# EAGLE design megajolt2 (EAGLE 4.16)
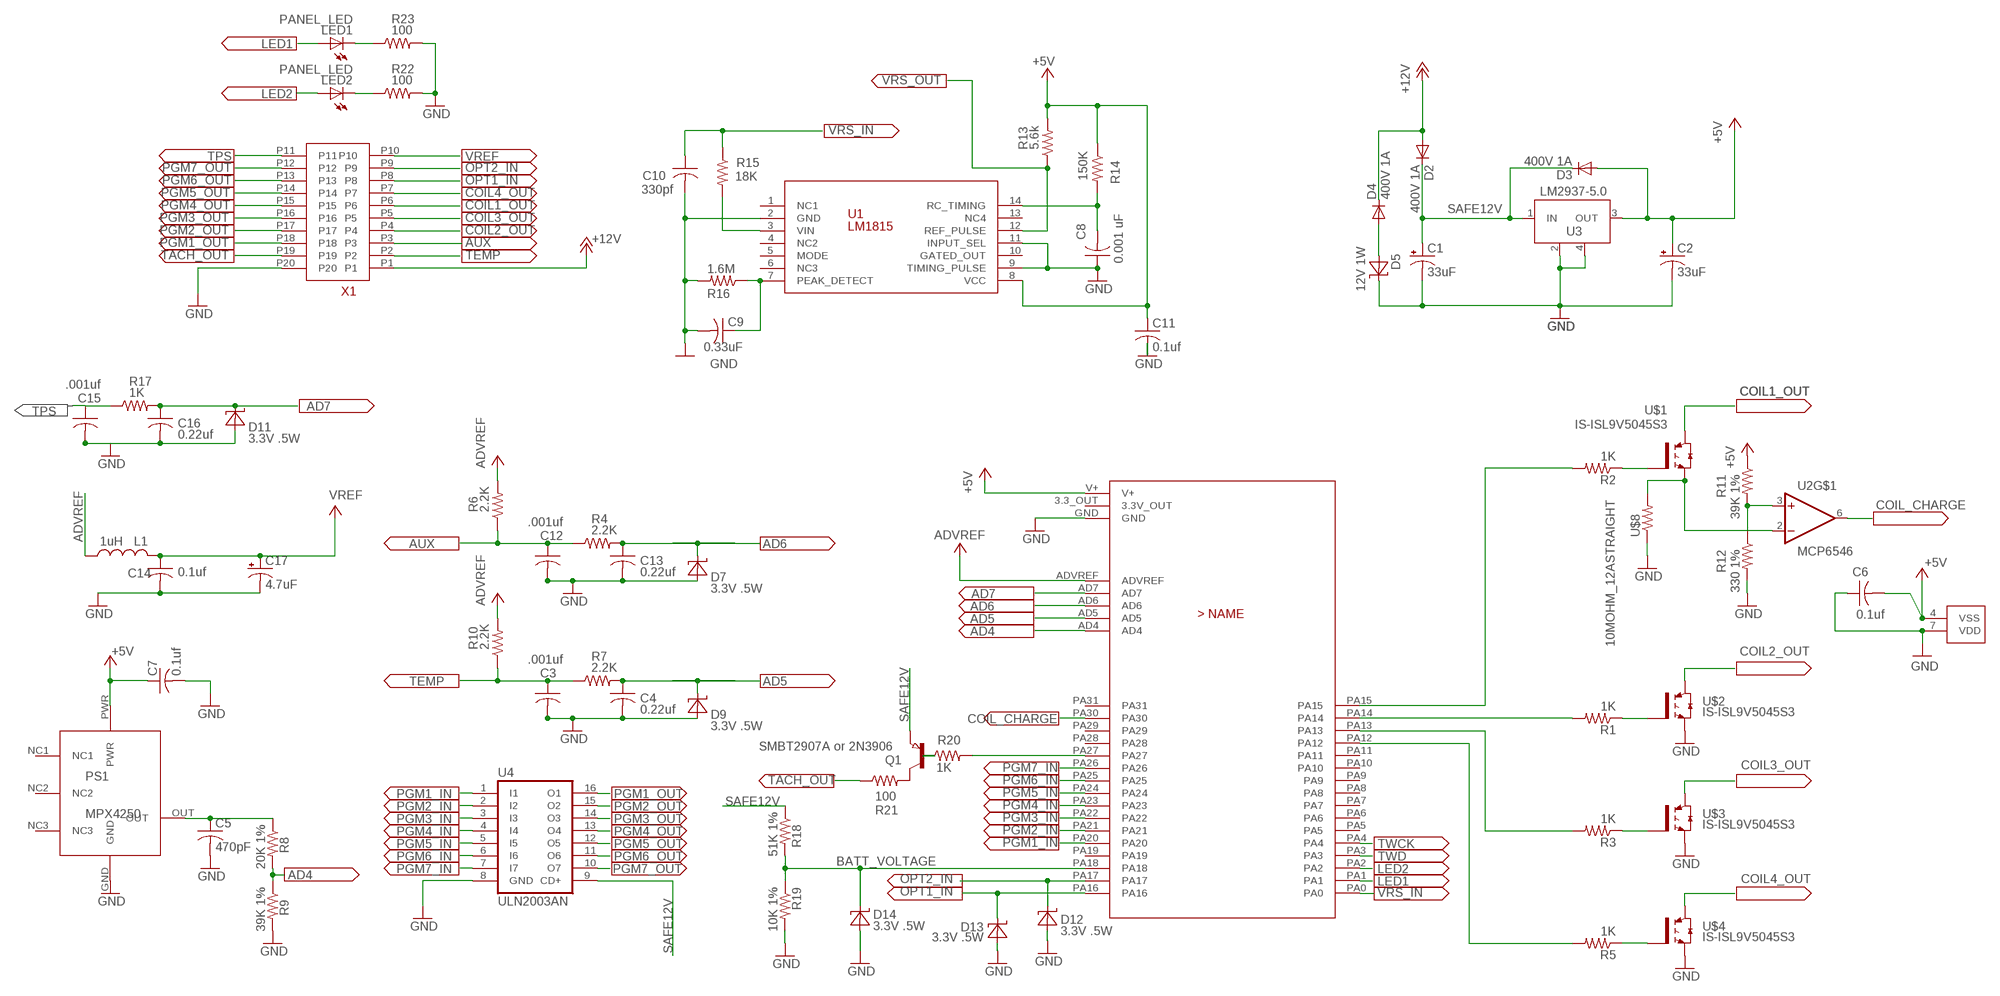
[diagram p0: schematic, sheet 1]

## Parts
C1  33uF  CPOL-US153CLV-0605  [153CLV-0605]
C2  33uF  CPOL-USSMCD  [SMC_D]
C3  .001uf  C-USC1206K  [C1206K]
C4  0.22uf  C-USC1206K  [C1206K]
C5  470pF  C-USC1206K  [C1206K]
C6  0.1uf  C-USC1206K  [C1206K]
C7  0.1uf  C-USC1206K  [C1206K]
C8  0.001 uF  C-USC1206K  [C1206K]
C9  0.33uF  C-USC1206K  [C1206K]
C10  330pf  C-USC1206K  [C1206K]
C11  0.1uf  C-USC1206K  [C1206K]
C12  .001uf  C-USC1206K  [C1206K]
C13  0.22uf  C-USC1206K  [C1206K]
C14  0.1uf  C-USC1206K  [C1206K]
C15  .001uf  C-USC1206K  [C1206K]
C16  0.22uf  C-USC1206K  [C1206K]
C17  4.7uF  CPOL-USSMCD  [SMC_D]
CPU_MODULE  CPU_MODULE  [CPU_MODULE]
D2  400V 1A  DIODE1  [SMA]
D3  400V 1A  DIODE1  [SMA]
D4  400V 1A  DIODE1  [SMA]
D5  12V 1W  ZENER2  [SOD123]
D7  3.3V .5W  ZENER2  [SOD123]
D9  3.3V .5W  ZENER2  [SOD123]
D11  3.3V .5W  ZENER2  [SOD123]
D12  3.3V .5W  ZENER2  [SOD123]
D13  3.3V .5W  ZENER2  [SOD123]
D14  3.3V .5W  ZENER2  [SOD123]
L1  1uH  INDUCTOR  [1210]
LED1  PANEL_LED  [RIGHTANGLE_CML_5323F5]
LED2  PANEL_LED  [RIGHTANGLE_CML_5323F5]
PS1  MPX4250  [MPX4250]
Q1  SMBT2907A or 2N3906  PNP-TRANSISTOR_SOT23  [SOT23]
R1  1K  R-US_M1206  [M1206]
R2  1K  R-US_M1206  [M1206]
R3  1K  R-US_M1206  [M1206]
R4  2.2K  R-US_M1206  [M1206]
R5  1K  R-US_M1206  [M1206]
R6  2.2K  R-US_M1206  [M1206]
R7  2.2K  R-US_M1206  [M1206]
R8  20K 1%  R-US_M1206  [M1206]
R9  39K 1%  R-US_M1206  [M1206]
R10  2.2K  R-US_M1206  [M1206]
R11  39K 1%  R-US_M1206  [M1206]
R12  330 1%  R-US_M1206  [M1206]
R13  5.6k  R-US_M1206  [M1206]
R14  150K  R-US_M1206  [M1206]
R15  18K  R-US_M1206  [M1206]
R16  1.6M  R-US_M1206  [M1206]
R17  1K  R-US_R1206  [R1206]
R18  51K 1%  R-US_M1206  [M1206]
R19  10K 1%  R-US_M1206  [M1206]
R20  1K  R-US_M1206  [M1206]
R21  100  R-US_M1206  [M1206]
R22  100  R-US_M1206  [M1206]
R23  100  R-US_M1206  [M1206]
U1  LM1815  [DIL14]
U2  MCP6546  [DIL08]
U3  LM2937-5.0  LM2937  [SOT223]
U4  ULN2003AN  [DIL16]
U$1  IS-ISL9V5045S3  [D2-PAK]
U$2  IS-ISL9V5045S3  [D2-PAK]
U$3  IS-ISL9V5045S3  [D2-PAK]
U$4  IS-ISL9V5045S3  [D2-PAK]
U$8  10MOHM_12ASTRAIGHT  [10MOHM_STRAIGHT_12A_CAPACITY]
X1  MOLEX_MINIFIT-20  MOLEX_MINIFIT-20NO_PEG  [MOLEX_MINIFIT-20_NO_PEG]

## Nets
+5V: C2.+ C6.2 C7.1 C11.1 CPU_MODULE.V+ D3.A PS1.PWR R11.1 R13.2 R14.1 U1.8(VCC) U2.4(VSS) U3.3(OUT)
+12V: D2.A D4.C X1.P1
AD4: CPU_MODULE.AD4 R8.2 R9.1
AD5: C4.1 CPU_MODULE.AD5 D9.C R7.2
AD6: C13.1 CPU_MODULE.AD6 D7.C R4.2
AD7: C16.1 CPU_MODULE.AD7 D11.C R17.2
ADVREF: CPU_MODULE.ADVREF L1.1
AUX: C12.1 R4.1 R6.1 X1.P3
BATT_VOLTAGE: CPU_MODULE.PA18 D14.C R18.2 R19.1
COIL1_DRIVE: CPU_MODULE.PA15 R2.2
COIL1_OUT: U$1.2(C) X1.P6
COIL2_DRIVE: CPU_MODULE.PA14 R1.2
COIL2_OUT: U$2.2(C) X1.P4
COIL3_DRIVE: CPU_MODULE.PA13 R3.2
COIL3_OUT: U$3.2(C) X1.P5
COIL4_DRIVE: CPU_MODULE.PA12 R5.2
COIL4_OUT: U$4.2(C) X1.P7
COIL_CHARGE: CPU_MODULE.PA30 U2.6(OUT)
GND: C1.- C2.- C3.2 C4.2 C5.2 C6.1 C7.2 C8.1 C9.2 C10.2 C11.2 C12.2 C13.2 C14.2 C15.2 C16.2 C17.- CPU_MODULE.GND D5.C D7.A D9.A D11.A D12.A D13.A D14.A PS1.GND R9.2 R12.2 R16.2 R19.2 R22.2 R23.2 U1.2(GND) U1.9(TIMING_PULSE) U1.11(INPUT_SEL) U2.7(VDD) U3.2(GND) U3.4(GND_TAB) U4.8(GND) U$2.3(E) U$3.3(E) U$4.3(E) U$8.P$1 X1.P20
LED1: CPU_MODULE.PA1 LED1.A
LED2: CPU_MODULE.PA2 LED2.A
N$1: R2.1 U$1.1(G)
N$2: R1.1 U$2.1(G)
N$5: D4.A D5.A
N$7: R3.1 U$3.1(G)
N$9: R5.1 U$4.1(G)
N$10: R11.2 R12.1 U2.3(+IN)
N$11: U2.2(-IN) U$1.3(E) U$8.P$2
N$12: C5.1 PS1.OUT R8.1
N$13: C8.2 R14.2 U1.14(RC_TIMING)
N$15: R15.2 U1.3(VIN)
N$16: C9.1 R16.1 U1.7(PEAK_DETECT)
N$19: Q1.1(B) R20.1
N$20: CPU_MODULE.PA27 R20.2
N$21: LED1.C R23.1
N$22: LED2.C R22.1
OPT1_IN: CPU_MODULE.PA16 D13.C X1.P8
OPT2_IN: CPU_MODULE.PA17 D12.C X1.P9
PGM1_IN: CPU_MODULE.PA20 U4.1(I1)
PGM1_OUT: U4.16(O1) X1.P18
PGM2_IN: CPU_MODULE.PA21 U4.2(I2)
PGM2_OUT: U4.15(O2) X1.P17
PGM3_IN: CPU_MODULE.PA22 U4.3(I3)
PGM3_OUT: U4.14(O3) X1.P16
PGM4_IN: CPU_MODULE.PA23 U4.4(I4)
PGM4_OUT: U4.13(O4) X1.P15
PGM5_IN: CPU_MODULE.PA24 U4.5(I5)
PGM5_OUT: U4.12(O5) X1.P14
PGM6_IN: CPU_MODULE.PA25 U4.6(I6)
PGM6_OUT: U4.11(O6) X1.P13
PGM7_IN: CPU_MODULE.PA26 U4.7(I7)
PGM7_OUT: U4.10(O7) X1.P12
SAFE12V: C1.+ D2.C D3.C Q1.2(E) R18.1 U3.1(IN) U4.9(CD+)
TACH_OUT: R21.1 X1.P19
TACH_OUT_TRANSISTOR: Q1.3(C) R21.2
TEMP: C3.1 R7.1 R10.1 X1.P2
TPS: C15.1 R17.1 X1.P11
TWCK: CPU_MODULE.PA4
TWD: CPU_MODULE.PA3
VCCIO: R6.2 R10.2 ; supply symbol labelled ADVREF
VREF: C14.1 C17.+ L1.2 X1.P10
VRS_IN: C10.1 CPU_MODULE.PA0 R15.1
VRS_OUT: R13.1 U1.12(REF_PULSE)
Unconnected: CPU_MODULE.3.3_OUT(3.3V_OUT) CPU_MODULE.PA5 CPU_MODULE.PA6 CPU_MODULE.PA7 CPU_MODULE.PA8 CPU_MODULE.PA9 CPU_MODULE.PA10 CPU_MODULE.PA11 CPU_MODULE.PA19 CPU_MODULE.PA28 CPU_MODULE.PA29 CPU_MODULE.PA31 U1.1(NC1) U1.4(NC2) U1.5(MODE) U1.6(NC3) U1.10(GATED_OUT) U1.13(NC4)

## Power pins joined to a net without a drawn wire
NC1: PS1.NC1
NC2: PS1.NC2
NC3: PS1.NC3

## Library data of the parts
C1 C2 C17 = rcl:CPOL-US: POLARIZED CAPACITOR, American symbol
C3-C16 = rcl:C-US: CAPACITOR, American symbol
CPU_MODULE = cpu_module:CPU_MODULE
D2-D4 = smt_diodes:DIODE
D5 D7 D9 D11-D14 = smt_diodes:ZENER
L1 = smt_inductors:INDUCTOR
LED1 LED2 = LEDs:PANEL_LED
PS1 = pressure_sensor:MPX4250
Q1 = semicon-smd-ipc:PNP-TRANSISTOR_: PNP TRANSISTOR
R1-R23 = rcl:R-US_: RESISTOR, American symbol
U1 = lm1815:LM1815
U2 = microchip_comparators:MCP6546
U3 = voltage_regulators:LM2937
U4 = uln-udn:ULN2003A: DRIVER ARRAY
U$1-U$4 = Fairchild_ecospark_IGBT:IS-ISL9V5045S3
U$8 = current_sense_trace:10MOHM_12A
X1 = molex_mini-fit:MOLEX_MINIFIT-20

## Board
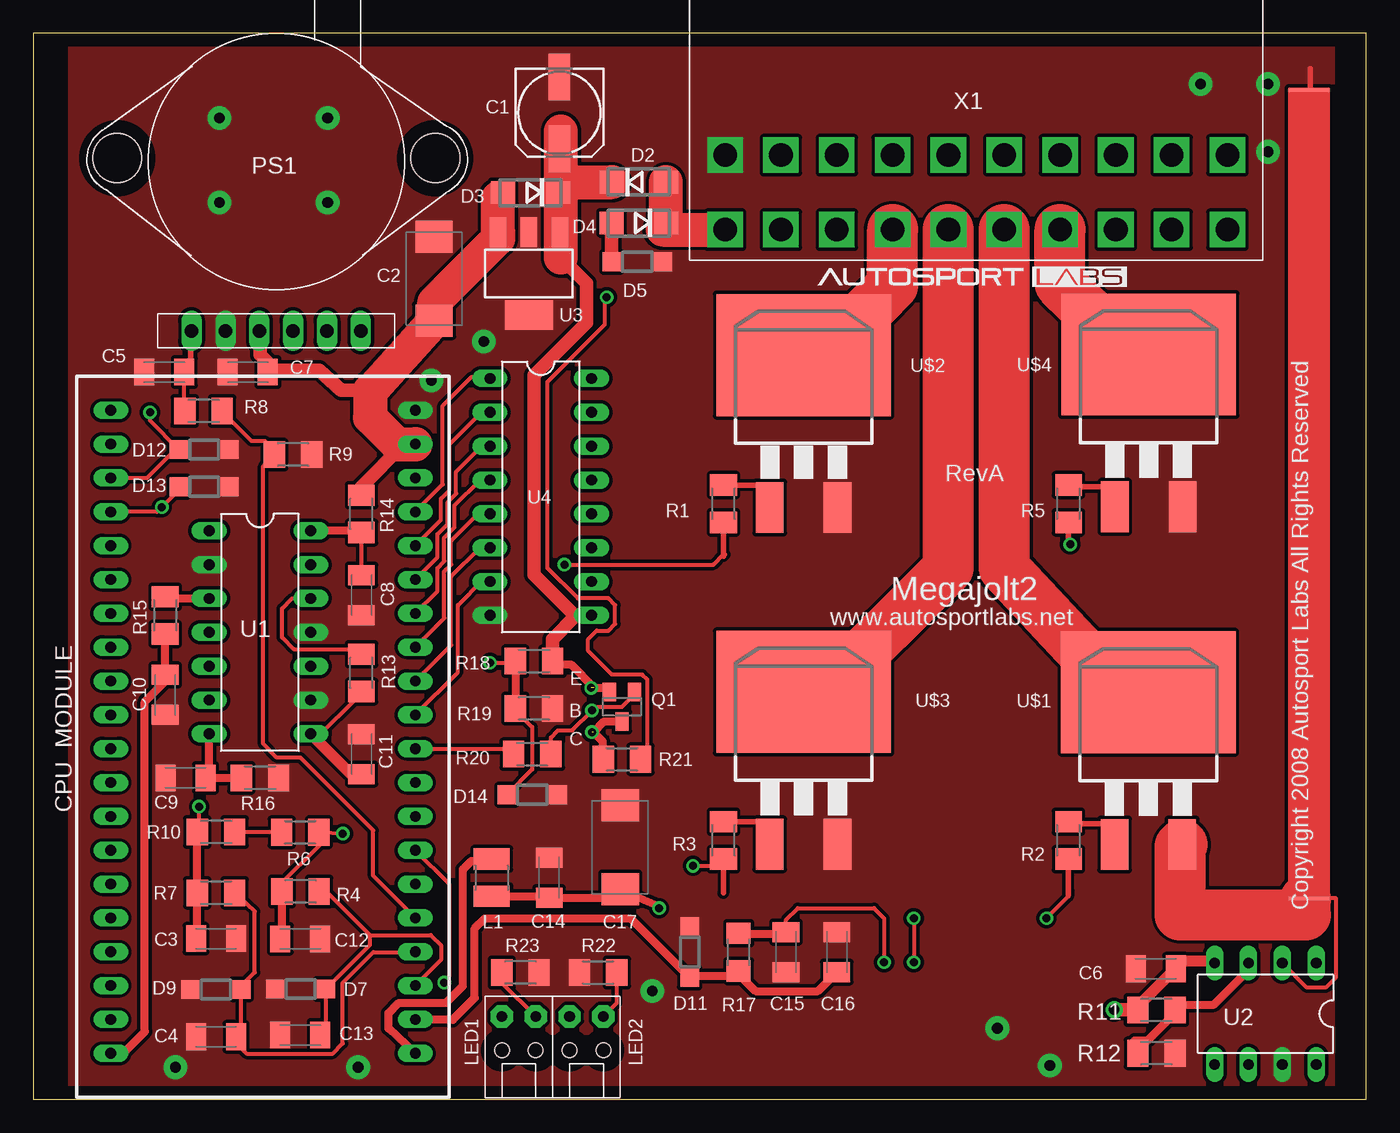
[diagram p1: board, top side]
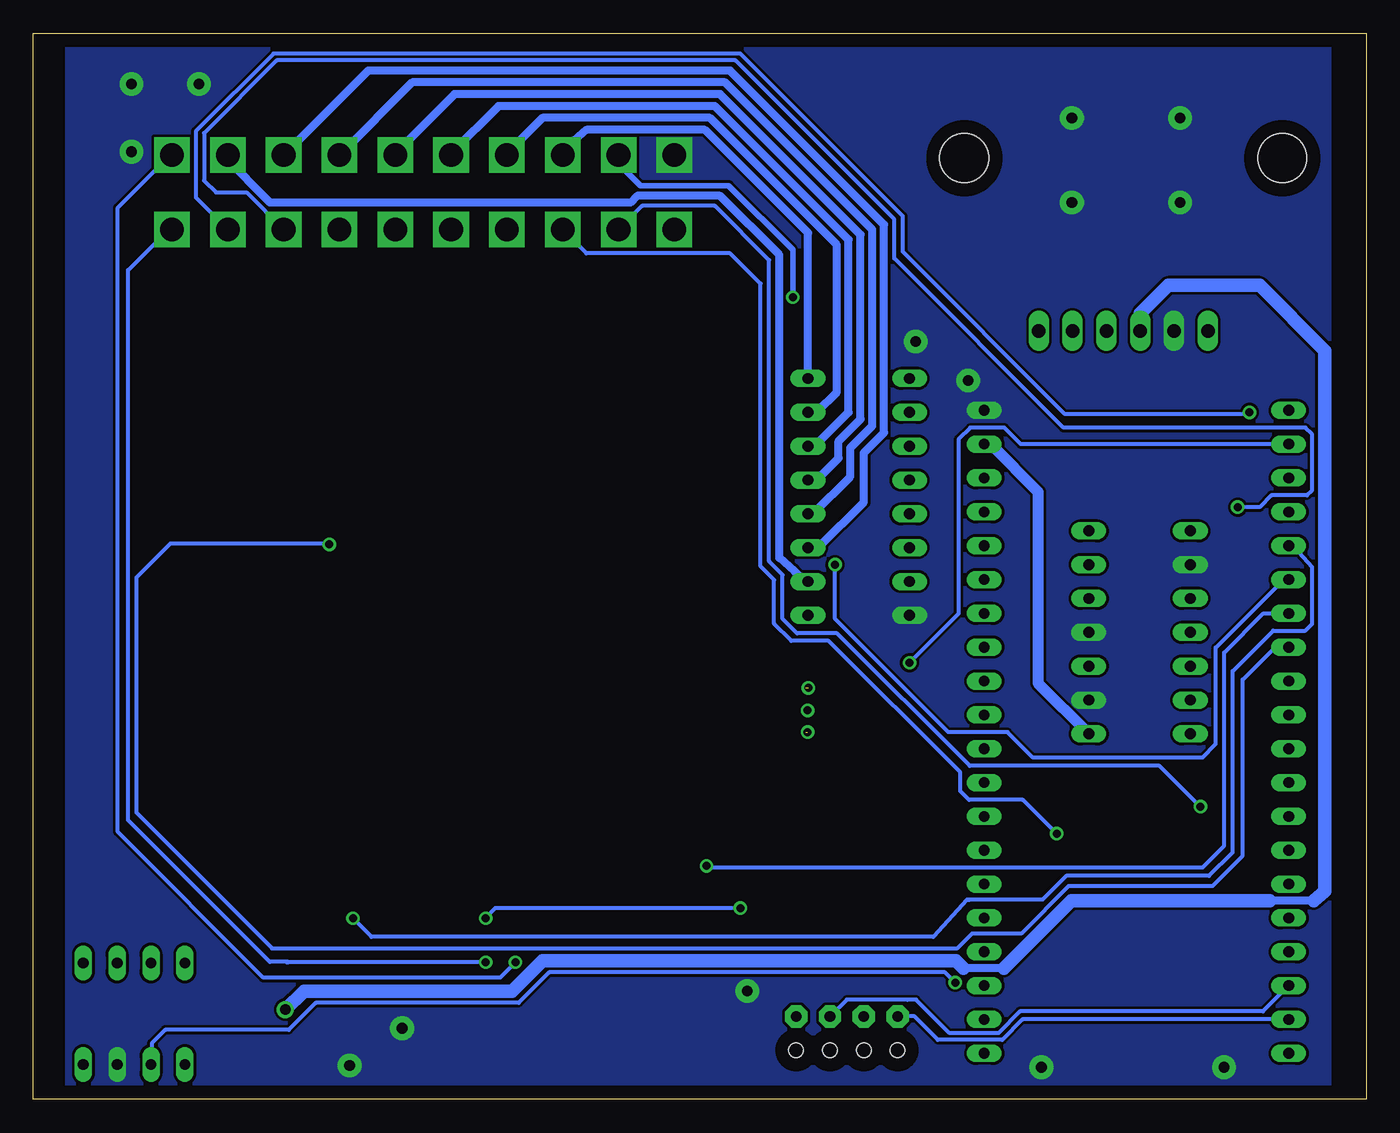
[diagram p2: board, bottom side, seen from below]

Size 100.08 x 80.01 mm. Coordinates in mm from the lower left corner, seen from the top.
Outline: 0,0 100.08,0 100.08,80.01 0,80.01 0,0
Copper layers (1*16): Top 0.035mm / dielectric 1.5mm / Bottom 0.035mm
Design rules "default": minimum track width 10mil, minimum drill 24mil, track to track 8mil, track to pad 8mil, pad to pad 8mil, via to via 8mil, smd to smd 8mil, copper to edge 40mil, drill to drill 8mil, minimum pad ring 10mil, minimum via ring 8mil, stop-mask expansion 4mil, vias tented up to drill 0mil, thermal gap 10mil

### Footprints (pad centres in the part's own frame; a part is rotated, then mirrored left to right if it is on the bottom)
153CLV-0605 = smd 3.5 x 1.6: + 2.7,0; - -2.7,0
SMC_D = smd 2.4 x 2.8: + -3.15,0; - 3.15,0
C1206K = smd 1.5 x 2: 1 -1.5,0; 2 1.5,0
CPU_MODULE = drill 0.8 long: 3.3_OUT -20.32,12.7; AD4 12.7,12.7; AD5 15.24,12.7; AD6 17.78,12.7; AD7 20.32,12.7; ADVREF 22.86,12.7; GND -25.4,12.7; PA0 22.86,-10.16; PA1 20.32,-10.16; PA2 17.78,-10.16; PA3 15.24,-10.16; PA4 12.7,-10.16; PA5 10.16,-10.16; PA6 7.62,-10.16; PA7 5.08,-10.16; PA8 2.54,-10.16; PA9 0,-10.16; PA10 -2.54,-10.16; PA11 -5.08,-10.16; PA12 -7.62,-10.16; PA13 -10.16,-10.16; PA14 -12.7,-10.16; PA15 -15.24,-10.16; PA16 -17.78,-10.16; PA17 -20.32,-10.16; PA18 -22.86,-10.16; PA19 -25.4,-10.16; PA20 -17.78,12.7; PA21 -15.24,12.7; PA22 -12.7,12.7; PA23 -10.16,12.7; PA24 -7.62,12.7; PA25 -5.08,12.7; PA26 -2.54,12.7; PA27 0,12.7; PA28 2.54,12.7; PA29 5.08,12.7; PA30 7.62,12.7; PA31 10.16,12.7; V+ -22.86,12.7
SMA = smd 1.8 x 1.7: A 2.05,0; C -2.05,0
SOD123 = smd 1.4 x 1.4: A 1.9,0; C -1.9,0
1210 = smd 1.6 x 2.7: 1 -1.4,0; 2 1.4,0
RIGHTANGLE_CML_5323F5 = drill 0.8 pad 1.676 octagon: A -1.27,1.651; C 1.27,1.651 | hole 1.1: 1.27,-0.889; -1.27,-0.889
MPX4250 = drill 1.016 long: GND 3.81,0; NC1 -1.27,0; NC2 -3.81,0; NC3 -6.35,0; OUT 6.35,0; PWR 1.27,0 | hole 3.683: -11.938,-12.954; 11.938,-12.954
SOT23 = smd 1 x 1.4: 1 -0.95,-1.1; 2 0.95,-1.1; 3 0,1.1
M1206 = smd 1.6 x 2: 1 -1.4,0; 2 1.4,0
R1206 = smd 1.6 x 1.803: 1 -1.422,0; 2 1.422,0
DIL14 = drill 0.813 long: 1 -7.62,-3.81; 2 -5.08,-3.81; 3 -2.54,-3.81; 4 0,-3.81; 5 2.54,-3.81; 6 5.08,-3.81; 7 7.62,-3.81; 8 7.62,3.81; 9 5.08,3.81; 10 2.54,3.81; 11 0,3.81; 12 -2.54,3.81; 13 -5.08,3.81; 14 -7.62,3.81
DIL08 = drill 0.813 long: 1 -3.81,-3.81; 2 -1.27,-3.81; 3 1.27,-3.81; 4 3.81,-3.81; 5 3.81,3.81; 6 1.27,3.81; 7 -1.27,3.81; 8 -3.81,3.81
SOT223 = smd 1.219 x 2.235: 1 -2.311,-3.099; 2 0,-3.099; 3 2.311,-3.099 | smd 3.6 x 2.2: 4 0,3.099
DIL16 = drill 0.813 long: 1 -8.89,-3.81; 2 -6.35,-3.81; 3 -3.81,-3.81; 4 -1.27,-3.81; 5 1.27,-3.81; 6 3.81,-3.81; 7 6.35,-3.81; 8 8.89,-3.81; 9 8.89,3.81; 10 6.35,3.81; 11 3.81,3.81; 12 1.27,3.81; 13 -1.27,3.81; 14 -3.81,3.81; 15 -6.35,3.81; 16 -8.89,3.81
D2-PAK = smd 2.083 x 3.81: 1 -2.54,-10.16; 3 2.54,-10.16 | smd 13.107 x 9.144: 2 0,1.27
10MOHM_STRAIGHT_12A_CAPACITY = smd 0.254 x 3.048: P$1 0.127,1.524; P$2 60.833,1.524
MOLEX_MINIFIT-20_NO_PEG = drill 1.778 pad 2.54 square: P1 -18.923,-2.794; P2 -14.732,-2.794; P3 -10.541,-2.794; P4 -6.35,-2.794; P5 -2.159,-2.794; P6 2.032,-2.794; P7 6.223,-2.794; P8 10.414,-2.794; P9 14.605,-2.794; P10 18.796,-2.794; P11 18.796,2.794; P12 14.605,2.794; P13 10.414,2.794; P14 6.223,2.794; P15 2.032,2.794; P16 -2.159,2.794; P17 -6.35,2.794; P18 -10.541,2.794; P19 -14.732,2.794; P20 -18.923,2.794

### Placement (x,y rotation side)
C1  39.5,74.04 270 top
C2  30.1,61.59 90 top
C3  13.72,12.06 0 top
C4  13.72,4.7 180 top
C5  9.83,54.58 180 top
C6  84.28,9.8 0 top
C7  16.1,54.58 180 top
C8  24.64,37.85 90 top
C9  11.43,24.13 180 top
C10  9.91,30.35 270 top
C11  24.64,25.91 90 top
C12  20.04,12.04 0 top
C13  20.04,4.83 180 top
C14  38.73,16.64 90 top
C15  56.52,11.05 270 top
C16  60.33,11.05 90 top
C17  44.07,18.92 90 top
CPU_MODULE  15.98,26.31 270 top
D2  45.47,68.83 0 top
D3  37.34,68.07 180 top
D4  45.47,65.79 180 top
D5  45.34,62.87 180 top
D7  20.07,8.28 180 top
D9  13.72,8.26 180 top
D11  49.28,11.05 90 top
D12  12.83,48.77 0 top
D13  12.83,45.97 0 top
D14  37.47,22.86 0 top
L1  34.42,16.64 270 top
LED1  36.45,4.57 0 top
LED2  41.53,4.57 0 top
PS1  18.24,57.68 180 top
Q1  44.2,29.46 180 top
R1  51.82,44.7 270 top
R2  77.72,19.43 270 top
R3  51.82,19.43 270 top
R4  20.07,15.6 0 top
R5  77.72,44.7 270 top
R6  20.04,20.04 180 top
R7  13.72,15.49 0 top
R8  12.78,51.66 0 top
R9  19.51,48.39 0 top
R10  13.72,20.07 0 top
R11  84.33,6.71 0 top
R12  84.33,3.45 0 top
R13  24.64,32 270 top
R14  24.64,43.94 270 top
R15  9.91,36.32 90 top
R16  17.02,24.13 0 top
R17  52.96,11.05 270 top
R18  37.59,32.89 180 top
R19  37.59,29.34 0 top
R20  37.47,25.91 180 top
R21  44.2,25.53 180 top
R22  42.42,9.53 180 top
R23  36.58,9.53 0 top
U1  17.02,35.05 270 top
U2  92.51,6.43 180 top
U3  37.21,61.98 180 top
U4  38.1,45.21 270 top
U$1  83.72,29.29 0 top
U$2  57.84,54.58 0 top
U$3  57.84,29.31 0 top
U$4  83.74,54.64 0 top
U$8  94.26,75.9 270 top
X1  70.87,68.07 0 top

### Tracks (layer width: path | path; a pad name or v marks a point on that pad's centre or on a via)
+5V  (via drill 0.8 pad 1.27)
  Top 0.254: 24.13,30.48 R13.2 | D3.A 35.56,68.58 34.9,67.67
  Top 0.305: R13.2 24.64,31.24 | 24.13,30.48 24.13,29.97 21.59,27.43 20.95,27.43 20.83,27.56 U1.8
  Top 0.61: 18.16,54.74 17.5,55.35 C7.1 | PS1.PWR 16.97,58.47 | 85.47,10.41 85.47,10.37 C6.2 | 88.37,10.41 U2.4 | C6.2 85.47,10.26 | C6.2 85.5,10.29 85.47,10.29 85.47,10.01 | 85.85,9.91 85.78,9.83 C6.2 | R11.1 82.93,6.98
  Top 0.813: 85.47,10.41 88.37,10.41 | 24.66,24.38 24.77,24.38 | 24.66,24.38 C11.1 | U1.8 23.88,24.38 24.66,24.38 | R11.1 82.91,6.71 | 82.93,6.98 85.78,9.83
  Top 1.016: 24.64,45.21 R14.1 24.64,45.97 27.81,49.15 | 25.27,53.21 23.11,53.21 21.46,54.74 18.16,54.74 17.02,55.88 17.02,58.5 | 17.02,58.5 17.02,58.55 | PS1.PWR 17.02,58.5 | R11.1 82.83,6.71 82.8,6.73 v81.15,6.73
  Top 2.54: C2.+ 30.1,58.93 | C2.+ 30.1,59.82 34.9,64.62 U3.3 34.9,67.67 | 25.27,53.11 C2.+ | 25.27,53.11 25.27,51.18 27.3,49.15 27.81,49.15 28.7,49.15 CPU_MODULE.V+ | 25.27,53.21 25.27,53.11
  Bottom 0.61: 16.84,58.43 17.02,58.48 | 16.84,58.43 PS1.PWR | 16.95,58.99 16.89,58.99 16.84,58.43 | 3.94,14.92 7.24,14.92 | 27.11,9.84 27.2,9.84 30.23,9.84
  Bottom 0.813: U1.8 24.64,31.24 24.64,45.59 28.19,49.15 28.7,49.15 | 28.7,49.15 28.83,49.15 | CPU_MODULE.V+ 28.7,49.15
  Bottom 1.016: 16.95,58.99 14.86,61.09 8,61.09 3.11,56.2 3.11,15.62 3.94,14.92 | 30.23,9.84 30.8,10.41 61.85,10.41 64.14,8.13 79.76,8.13 v81.15,6.73 | 27.2,9.84 27.2,9.86 22.14,14.92 7.24,14.92
+12V
  Top 0.61: 47.24,65.28 47.24,65.79 D4.C 47.5,65.79 | 47.5,68.83 D2.A
  Top 2.54: 47.24,65.28 X1.P1 | 47.5,65.79 47.5,68.83
AD4
  Top 0.254: R8.2 13.97,52.07 14.22,51.56
  Top 0.305: 28.7,13.59 CPU_MODULE.AD4 25.53,16.76 25.53,20.19 20.07,25.65 18.29,25.65 17.27,26.67 17.27,47.5 18.16,48.39 R9.1 17.53,49.28 17.4,49.4 16.38,49.4 14.22,51.56
AD5
  Top 0.305: R7.2 16.64,14.1 16.64,9.53 15.62,8.51 | 15.62,5.1 D9.C | 15.37,4.06 16,3.43 22.48,3.43 23.24,4.19 23.24,8.76 25.53,11.05 28.65,11.05 CPU_MODULE.AD5
  Top 0.61: 15.62,8.51 D9.C | C4.1 15.62,5.1 | 15.37,4.57 15.34,4.57 C4.1 | C4.1 15.37,4.7 15.37,4.06
AD6
  Top 0.305: CPU_MODULE.AD6 30.61,10.46 30.61,11.56 29.84,12.32 25.27,12.32 | 25.27,12.32 21.46,16.13 | D7.C 21.97,8.38 | D7.C 25.27,11.59 25.27,12.32 | C13.1 21.97,5.38 D7.C
  Top 0.61: 21.46,16.13 21.46,15.98 R4.2
AD7
  Top 0.305: D11.C 49.02,8.89
  Top 0.61: C16.1 58.9,8.13 54.23,8.13 52.96,9.4 | 52.96,9.78 R17.2 52.96,9.4 | 52.96,9.4 52.45,9.27 49.4,9.27 | 49.4,9.27 49.28,9.27 | CPU_MODULE.AD7 31.5,5.99 | 31.5,5.99 31.52,5.99 | 49.15,9.27 D11.C 49.4,9.27 | 49.15,9.27 49.4,9.27 | 49.15,9.27 44.83,13.59 33.91,13.59 33.15,12.83 33.15,7.62 31.5,5.97 31.5,5.99
ADVREF
  Top 0.61: CPU_MODULE.ADVREF 26.67,5.33 26.67,6.48 27.43,7.24 30.99,7.24 32.26,8.51 32.26,17.27 32.89,17.91 34.54,17.91 L1.1
AUX  (via drill 0.6)
  Top 0.305: 21.46,19.68 | 21.46,19.68 R6.1 21.57,20.04 21.59,20.07 v23.24,19.94 | 21.46,19.05 21.46,19.68 | 21.46,19.05 21.46,20.19 | 18.54,15.72 18.54,16.13 21.46,19.05
  Top 0.61: C12.1 18.57,12.06 18.67,12.06 R4.1 18.54,15.72
  Bottom 0.305: X1.P3 58.55,63.5 47.75,63.5 45.47,61.21 45.47,40.01 44.45,38.99 44.45,35.71 43.16,34.42 40.36,34.42 30.48,24.54 30.48,23.14 29.82,22.48 25.78,22.48 v23.24,19.94
BATT_VOLTAGE  (via drill 0.6)
  Top 0.305: D14.C 37.47,24.77 37.47,27.94 36.2,29.21 36.19,29.21 R19.1 | R18.2 36.07,32.77 v34.29,32.77
  Top 0.61: R19.1 36.2,29.21 | R19.1 | R18.2 R19.1
  Bottom 0.305: CPU_MODULE.PA18 25.93,49.17 27.18,50.42 29.72,50.42 30.61,49.53 30.61,36.45 v34.29,32.77
COIL1_DRIVE  (via drill 0.6)
  Top 0.305: 77.72,15.51 77.72,15.62 77.72,15.24 v76.07,13.59
  Top 0.406: 77.71,15.37 77.72,15.37 77.72,15.62 R2.2
  Bottom 0.305: 76.07,13.46 v76.07,13.59 74.68,12.19 32.51,12.19 29.97,14.99 | CPU_MODULE.PA15 5.82,41.68 5.71,41.78 4.06,39.94 4.06,35.69 4.57,35.18 6.99,35.18 10.03,32.13 10.03,18.54 11.81,16.76 22.53,16.76 24.31,14.99 29.97,14.99 | 29.97,14.99 29.77,14.99
COIL1_OUT
  Top 3.81: 82.17,30.48 82.19,30.5 U$1.2 | U$1.2 82.19,30.25 82.17,30.23 82.17,29.72 | 81.97,30.18 82.55,30.23 | 81.97,30.18 U$1.2 | 81.97,30.18 72.9,39.88 X1.P6
COIL2_DRIVE  (via drill 0.6)
  Top 0.305: 51.82,40.77 51.94,40.89 51.82,41.02 | 51.8,40.88 51.82,40.89 51.05,40.13 v39.88,40.13
  Top 0.406: 51.82,40.77 51.82,40.89 R1.2
  Bottom 0.305: CPU_MODULE.PA14 6.2,39.01 11.3,33.91 11.3,26.67 12.32,25.65 25.02,25.65 26.92,27.56 31.37,27.56 39.88,36.07 v39.88,40.13
COIL2_OUT
  Top 3.81: 59.36,55.8 59.31,55.75 | U$2.2 59.36,55.8 | 59.36,55.8 64.52,61.09 X1.P4
COIL3_DRIVE  (via drill 0.6)
  Top 0.305: R3.2 51.94,17.91 51.56,17.53 v49.53,17.53
  Top 0.406: R3.2 51.82,15.49
  Bottom 0.305: CPU_MODULE.PA13 7.72,36.47 10.67,33.53 10.67,19.05 12.32,17.4 49.4,17.4 v49.53,17.53
COIL3_OUT
  Top 3.81: U$3.2 59.41,30.58 68.71,39.88 X1.P5
COIL4_DRIVE  (via drill 0.6)
  Top 0.406: v77.85,41.66 77.98,41.66 77.72,41.91 R5.2
  Bottom 0.305: CPU_MODULE.PA12 6.83,33.93 9.27,31.5 9.27,18.29 11.56,16 22.35,16 25.91,12.45 29.59,12.45 30.73,11.3 82.12,11.3 | 82.12,11.3 82.17,11.3 | 82.12,11.3 92.33,21.51 92.33,39.17 89.76,41.73 78.05,41.73 77.98,41.66 v77.85,41.66
COIL4_OUT
  Top 3.81: 82.53,55.91 82.55,55.88 | U$4.2 82.53,55.91 | 82.53,55.91 77.09,61.21 X1.P7
COIL_CHARGE  (via drill 0.6)
  Top 0.305: CPU_MODULE.PA30 31.24,16.13 31.24,9.27 30.86,8.89 v30.86,8.76
  Bottom 0.305: v30.86,8.76 31.62,9.53 61.34,9.53 63.63,7.24 78.87,7.24 80.9,5.21 90.17,5.21 91.19,4.19 91.19,2.54 91.24,2.59 U2.6
GND  (via drill 0.8 pad 1.78)
  Top 0.406: U$8.P$1 95.89,75.67 95.89,77.34
  other vias: 46.48,8.13 24.38,2.41 72.39,5.33 76.33,2.54 87.63,76.2 92.71,76.2 92.71,71.12 10.67,2.41 13.97,73.66 22.1,73.66 22.1,67.31 13.97,67.31 29.9,53.95 33.83,56.87
  pour Top (isolate 0.254, no thermals): 2.79,79.76 97.51,79.76 97.51,75.82 93.73,75.82 93.73,11.43 97.54,11.43 97.54,0.51 2.79,0.51
  pour Bottom (no thermals): 2.74,79.76 97.56,79.76 97.56,0.66 2.74,0.66
LED1
  Bottom 0.305: CPU_MODULE.PA1 25.81,5.99 27.33,4.47 32.16,4.47 33.91,6.22 LED1.A 35.26,6.3
LED2
  Bottom 0.305: 34.47,7.49 34.42,7.49 | 34.47,7.49 38.99,7.49 LED2.A | 34.47,7.49 33.81,7.49 31.29,4.98 27.61,4.98 25.98,6.6 7.75,6.6 5.84,8.51 5.84,8.56 | 5.84,8.56 5.84,8.64 | CPU_MODULE.PA2 5.84,8.56
N$1
  Top 0.406: R2.1 77.72,20.7 81.18,20.7 U$1.1
N$2
  Top 0.406: R1.1 55.3,46.1 U$2.1
N$5
  Top 1.016: D5.A 43.44,62.99 43.42,63.01 D4.A
N$7
  Top 0.406: R3.1 55.3,20.83 U$3.1
N$9
  Top 0.406: R5.1 77.98,45.97 81.2,45.97 U$4.1
N$10
  Top 0.61: 82.68,3.94 82.8,3.96 R12.1 82.68,3.96 82.68,3.94 | 82.68,3.94 82.68,4.42 83.67,4.42 85.85,6.6 85.75,6.71 R11.2 85.73,6.98 85.6,7.11 88.65,7.11 91.24,9.7 U2.3
N$11
  Top 0.305: 95.5,13.46 95.5,13.84 95.5,14.53 U$8.P$2 95.71,14.73 | 96.65,14.73 96.77,15.11 97.79,15.11 97.79,9.14 97.03,8.38 95.63,8.38 U2.2 | 96.65,14.73 96.77,14.73 | 95.71,14.73 95.5,14.73 | 95.71,14.73 96.65,14.73
  Top 3.81: U$1.3 86.11,18.97 86.11,13.84 95.5,13.84 95.5,14.99
N$12
  Top 0.305: 11.18,52.32 11.25,52.25 R8.1 11.2,52.17 11.18,52.2 11.33,52.35 C5.1 11.33,55.02 11.3,54.99 11.25,55.04
  Top 0.406: PS1.OUT 11.86,58.42 11.81,58.42 11.81,55.6 11.25,55.04
N$13
  Top 0.305: C8.2 R14.2
  Top 0.61: R14.2 24.51,42.54 24.38,42.67 U1.14
N$15
  Top 0.61: R15.2 9.91,37.59 U1.3
N$16
  Top 0.61: U1.7 13.21,24.26 13.18,24.23 C9.1 R16.1
N$19  (via drill 0.6)
  Top 0.305: Q1.1 45.15,30.41 44.2,29.46 42.34,29.46 v41.94,29.18 41.99,29.21 40.46,27.69 39.4,27.69 38.86,27.15 38.86,26.06 38.89,26.04 38.87,26.01 R20.1
N$20
  Top 0.305: R20.2 35.94,25.91 35.53,26.31 CPU_MODULE.PA27
N$21
  Top 0.305: R23.1 35.18,8.77 LED1.C
N$22
  Top 0.305: R22.1 43.81,7.24 LED2.C
OPT1_IN  (via drill 0.6)
  Top 0.305: CPU_MODULE.PA16 9.3,44.09 v9.65,44.45 | v9.65,44.45 10.41,45.21 10.41,45.47 D13.C 10.93,45.73 v9.65,44.45
  Bottom 0.305: v9.65,44.45 8,44.45 7.11,45.34 4.45,45.34 4.06,45.72 4.06,49.91 4.57,50.42 22.73,50.42 35.43,63.12 35.43,66.04 47.37,77.98 81.79,77.98 87.25,72.52 87.25,68.96 86.36,68.07 84.07,68.07 X1.P8
OPT2_IN  (via drill 0.6)
  Top 0.305: CPU_MODULE.PA17 8.53,46.63 10.67,48.77 D12.C 8.76,50.93 v8.76,51.56
  Bottom 0.305: v8.76,51.56 8.89,51.44 22.61,51.44 34.8,63.63 34.8,66.29 46.99,78.49 82.04,78.49 87.88,72.64 87.88,67.69 X1.P9 85.6,65.41
PGM1_IN
  Top 0.305: CPU_MODULE.PA20 30.73,46.15 30.73,52.07 32.89,54.23 34.29,54.23 U4.1
PGM1_OUT
  Bottom 0.61: U4.16 41.91,65.02 49.66,72.77 58.55,72.77 60.71,70.87 X1.P18
PGM2_IN
  Top 0.305: CPU_MODULE.PA21 30.61,43.48 30.61,45.09 31.24,45.72 31.24,49.15 33.91,51.82 34.29,51.82 U4.2
PGM2_OUT
  Bottom 0.61: U4.15 41.27,51.56 39.75,53.09 39.75,64.14 49.28,73.66 61.85,73.66 64.64,70.87 X1.P17 64.64,70.74
PGM3_IN
  Top 0.305: CPU_MODULE.PA22 30.35,40.69 30.35,42.42 31.11,43.18 31.11,44.83 31.75,45.47 31.75,47.12 33.66,49.02 U4.3
PGM3_OUT
  Bottom 0.61: U4.14 41.27,49.15 38.86,51.56 38.86,64.52 48.9,74.55 65.15,74.55 68.71,70.99 X1.P16
PGM4_IN
  Top 0.305: CPU_MODULE.PA23 30.35,38.15 30.35,39.88 30.86,40.39 30.86,42.16 31.62,42.93 31.62,44.58 33.53,46.48 U4.4
PGM4_OUT
  Bottom 0.61: U4.13 41.4,46.48 41.15,46.74 41.02,46.74 39.62,48.13 39.62,49.4 37.97,51.05 37.97,64.9 48.51,75.44 68.45,75.44 73.03,70.87 X1.P15 72.9,70.99
PGM5_IN
  Top 0.305: CPU_MODULE.PA24 30.86,36.12 30.86,39.62 31.37,40.13 31.37,41.91 33.4,43.94 U4.5
PGM5_OUT
  Top 0.61: X1.P14 77.09,70.99
  Bottom 0.61: U4.12 41.53,43.94 38.73,46.74 38.73,48.9 37.08,50.55 37.08,65.28 48.13,76.33 71.63,76.33 X1.P14 77.22,70.87
PGM6_IN
  Top 0.305: CPU_MODULE.PA25 31.37,34.09 31.37,39.24 33.53,41.4 U4.6
PGM6_OUT
  Top 0.61: 81.28,70.74 X1.P13 81.28,70.99
  Bottom 0.61: U4.11 41.15,41.4 37.72,44.83 37.72,48.51 36.2,50.04 36.2,65.66 47.75,77.22 74.93,77.22 X1.P13 81.53,70.87
PGM7_IN
  Top 0.305: CPU_MODULE.PA26 31.88,32.05 31.88,37.08 33.78,38.99 34.42,38.99 U4.7
PGM7_OUT
  Bottom 0.61: U4.10 42.16,38.86 42.93,39.62 44.07,40.64 44.07,63.37 48.51,67.82 54.74,67.82 55.24,67.31 82.3,67.31 85.72,70.74 85.6,70.87 X1.P12 85.47,70.74
SAFE12V  (via drill 0.6)  (1 unrouted)
  Top 0.254: D3.C 39.37,68.58 39.62,68.58 | 39.62,66.04 39.37,66.04 U3.1 | 39.62,68.83 39.37,69.85 C1.+
  Top 0.61: 43.43,30.61 43.26,30.56 Q1.2 43.3,30.56 | 38.99,32.64 40.36,32.64 42.11,30.89 42.98,30.89 43.3,30.56 | 43.3,30.56 43.31,30.56
  Top 1.016: 39.62,63.17 41.53,61.27 41.53,58.29 37.59,54.36 37.59,39.37 40.64,36.32 U4.9 | U4.9 42.04,36.32 | 38.99,32.64 R18.1 38.99,32.77 | U4.9 40.77,36.32 38.99,34.54 38.99,32.77 | 38.99,32.77 38.86,32.64
  Top 2.54: 43.43,68.83 D2.C 39.62,68.83 | 39.62,63.17 39.62,66.04 39.62,68.58 39.62,68.83 | 39.62,68.83 39.62,72.64
  other vias: 41.88,30.89
TACH_OUT  (via drill 0.6)
  Top 0.305: v43.05,60.2 43.18,60.2 42.93,59.94 42.93,58.17 38.61,53.85 38.61,39.88 40.89,37.59 43.18,37.59 43.69,37.08 43.69,35.69 43.18,35.18 42.29,35.18 41.66,34.54 41.66,33.66 43.43,31.88 45.72,31.88 46.1,31.5 46.1,26.42 45.6,25.91 R21.1
  Bottom 0.406: v43.05,60.2 43.05,63.75 47.88,68.58 54.48,68.58 56.13,70.23
  Bottom 0.61: 56.13,71.12 X1.P19 56.13,70.23
TACH_OUT_TRANSISTOR  (via drill 0.6)  (1 unrouted)
  Top 0.61: 42.8,25.91 R21.2 42.77,25.55 42.77,26.85 42.06,27.56 42.87,28.36 Q1.3
  other vias: 41.94,27.56
TEMP  (via drill 0.6)
  Top 0.305: R10.1 12.32,20.19 12.45,20.32 v12.45,21.97
  Top 0.61: 12.32,15.87 12.32,15.75 | R10.1 12.32,15.87 | C3.1 12.32,12.17 12.32,15.87 | 12.32,15.87 R7.1
  Bottom 0.305: 56.01,65.28 X1.P2 54.36,67.06 48.9,67.06 44.83,62.99 44.83,40.39 43.81,39.37 43.81,36.07 42.72,34.98 39.73,34.98 29.77,25.02 15.52,25.02 12.45,21.95 v12.45,21.97
TPS  (via drill 0.6)
  Top 0.305: C15.1 56.52,13.46 57.4,14.35 63.12,14.35 63.88,13.59 v63.88,10.29
  Top 0.61: C15.1 56.52,12.45 52.98,12.45 R17.1
  Bottom 0.305: X1.P11 89.66,70.99 93.73,66.93 93.73,20.07 82.8,9.14 65.02,9.14 v63.88,10.29
VCCIO
  Top 0.305: 18.67,20.07 | 18.67,20.07 R6.2 | R10.2 18.67,20.07
VREF  (via drill 0.6)
  Top 0.305: v66.1,13.59 v66.1,10.29
  Top 0.61: L1.2 38.1,15.24 38.61,15.24 C14.1 43.28,15.14 43.03,15.52 | 43.03,15.52 44.2,15.49 | 43.03,15.52 C17.+ 46.97,14.5 46.99,14.48 v46.99,14.35
  Bottom 0.305: v46.99,14.35 65.41,14.35 v66.1,13.59 | v66.1,10.29 80.95,10.29 | 80.95,10.29 81.03,10.29 | X1.P10 89.92,65.28 92.96,62.23 92.96,20.95 82.32,10.31 80.95,10.31 80.95,10.29
VRS_IN
  Top 0.61: 9.91,31.88 R15.1 | 9.91,31.75 C10.1 9.91,31.88 | CPU_MODULE.PA0 5.84,3.43 6.73,3.43 8.38,5.08 8.38,29.84 9.91,31.37 9.91,31.88
VRS_OUT
  Top 0.305: R13.1 24.51,33.4 24.13,33.78 19.56,33.78 18.67,34.67 18.67,36.83 19.43,37.59 U1.12

### Text on the board
tPlace: RevA | Megajolt2 | www.autosportlabs.net | E | B | C | Copyright 2008 Autosport Labs All Rights Reserved